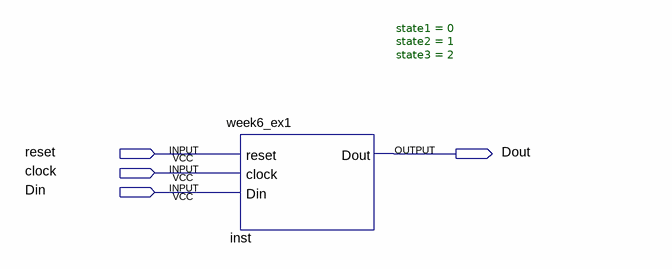
[diagram p0: schematic sheet]
// Quartus schematic week6_ex1_bdf.bdf as structural Verilog: 1 symbols, 4 pins
module week6_ex1_bdf (
  input  reset,
  input  clock,
  input  Din,
  output Dout
);

  week6_ex1 #(.state1(0), .state2(1), .state3(2)) inst (.reset(reset), .clock(clock), .Din(Din), .Dout(Dout));
endmodule
